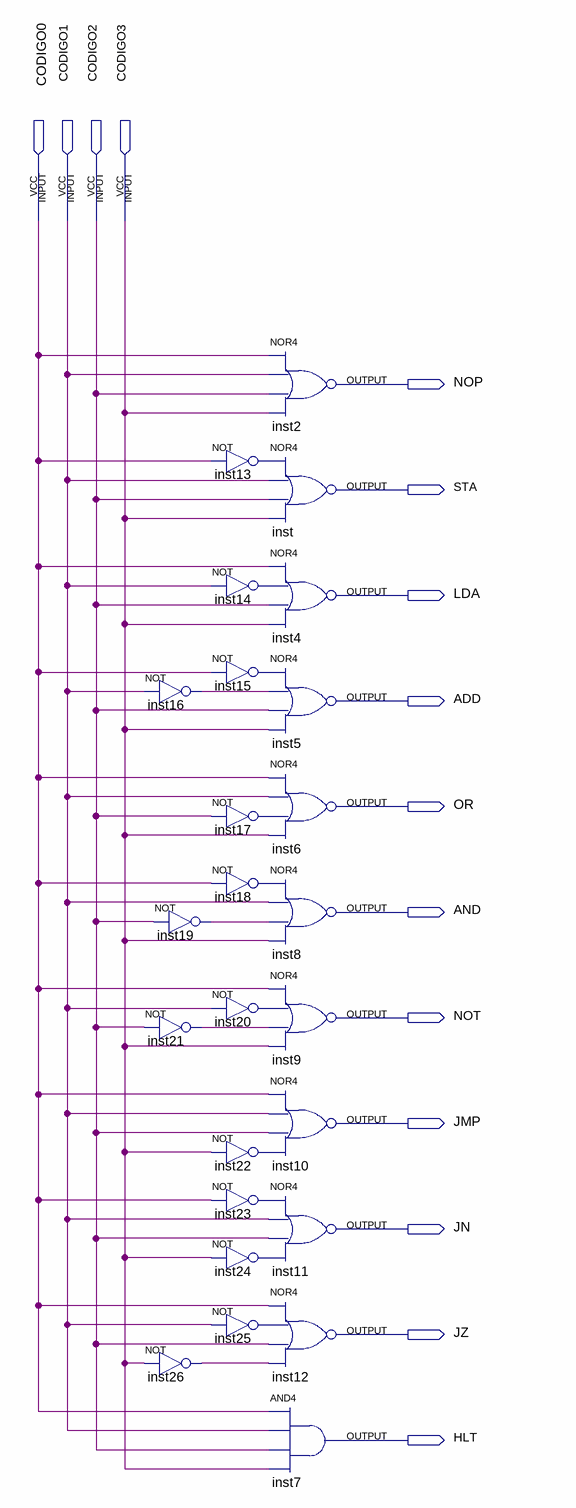
[diagram p0: schematic sheet]
// Quartus schematic decodificador_instrucoes.bdf as structural Verilog: 25 symbols, 15 pins
module decodificador_instrucoes (
  input  CODIGO0,
  input  CODIGO1,
  input  CODIGO2,
  input  CODIGO3,
  output NOP,
  output STA,
  output LDA,
  output ADD,
  output OR,
  output AND,
  output NOT,
  output JMP,
  output JN,
  output JZ,
  output HLT
);

  wire inst13_out, inst14_out, inst15_out, inst16_out, inst17_out, inst18_out, inst19_out, inst20_out,
       inst21_out, inst22_out, inst23_out, inst24_out, inst25_out, inst26_out;

  not inst16 (inst16_out, CODIGO1);
  not inst19 (inst19_out, CODIGO2);
  not inst21 (inst21_out, CODIGO2);
  not inst26 (inst26_out, CODIGO3);
  not inst13 (inst13_out, CODIGO0);
  not inst14 (inst14_out, CODIGO1);
  not inst15 (inst15_out, CODIGO0);
  not inst17 (inst17_out, CODIGO2);
  not inst18 (inst18_out, CODIGO0);
  not inst20 (inst20_out, CODIGO1);
  not inst22 (inst22_out, CODIGO3);
  not inst23 (inst23_out, CODIGO0);
  not inst24 (inst24_out, CODIGO3);
  not inst25 (inst25_out, CODIGO1);
  nor inst2 (NOP, CODIGO0, CODIGO1, CODIGO2, CODIGO3);
  nor inst (STA, inst13_out, CODIGO1, CODIGO2, CODIGO3);
  nor inst4 (LDA, CODIGO0, inst14_out, CODIGO2, CODIGO3);
  nor inst5 (ADD, inst15_out, inst16_out, CODIGO2, CODIGO3);
  nor inst6 (OR, CODIGO0, CODIGO1, inst17_out, CODIGO3);
  nor inst8 (AND, inst18_out, CODIGO1, inst19_out, CODIGO3);
  nor inst9 (NOT, CODIGO0, inst20_out, inst21_out, CODIGO3);
  nor inst10 (JMP, CODIGO0, CODIGO1, CODIGO2, inst22_out);
  nor inst11 (JN, inst23_out, CODIGO1, CODIGO2, inst24_out);
  nor inst12 (JZ, CODIGO0, inst25_out, CODIGO2, inst26_out);
  and inst7 (HLT, CODIGO0, CODIGO1, CODIGO2, CODIGO3);
endmodule
